# Altium schematic sheet UART_connect.SchDoc
size A4; DocumentNumber: 10; SheetNumber: 10; SheetTotal: 21; SheetName: UART to USB Bridge
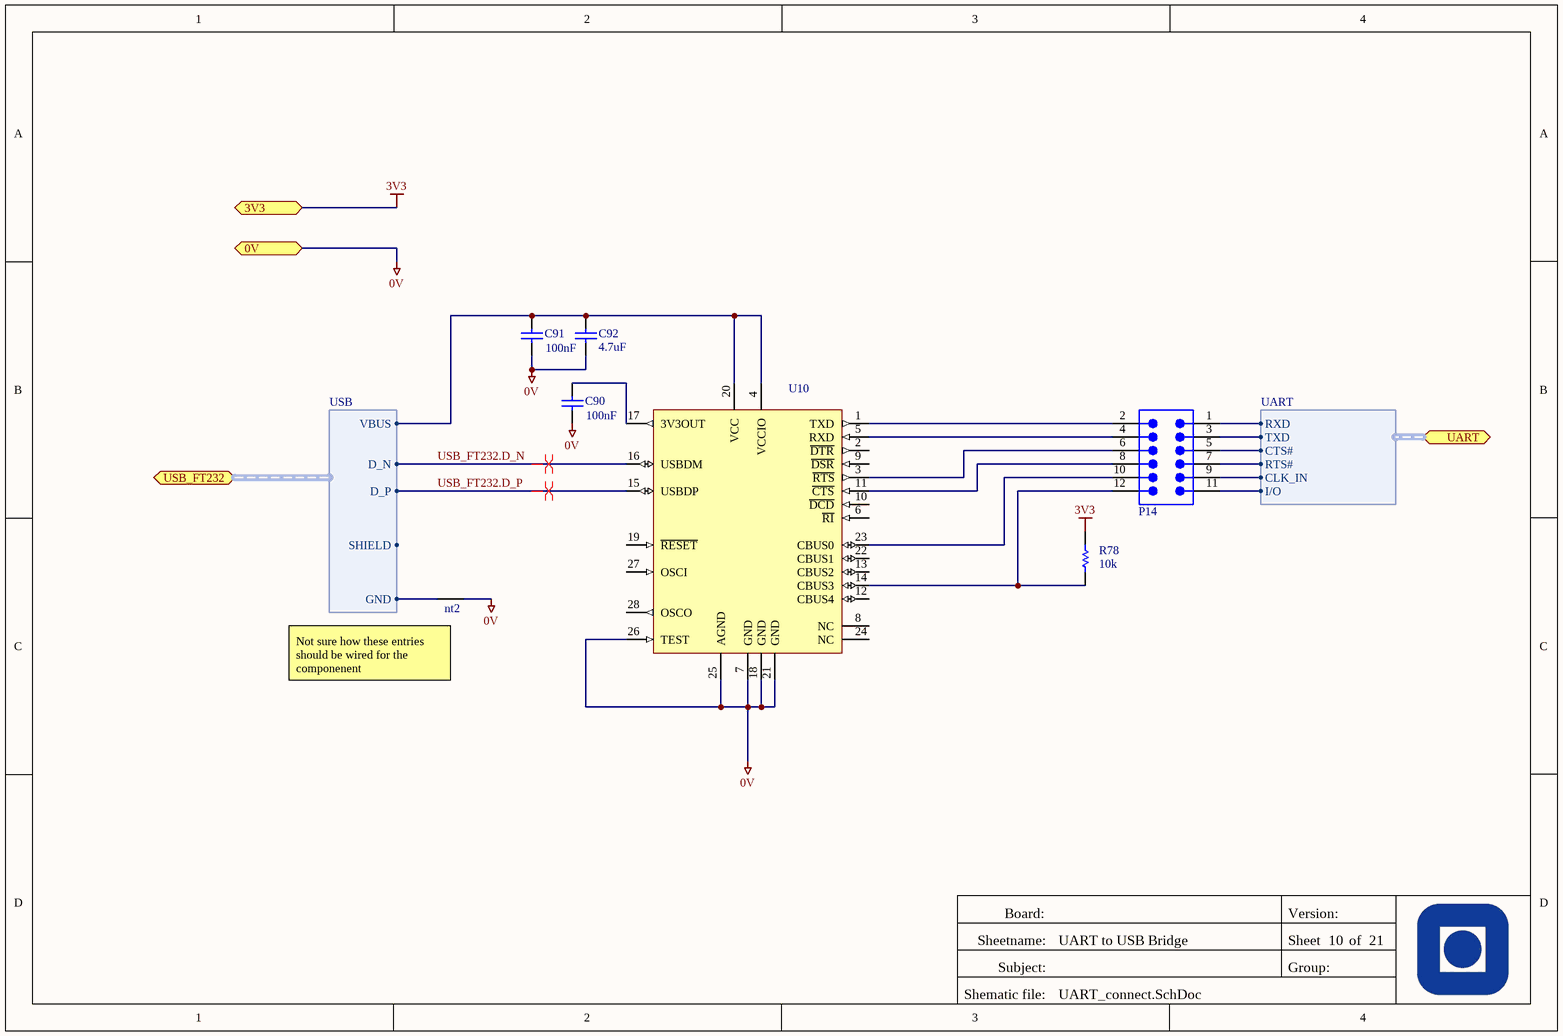
[diagram p0: UART_connect.SchDoc]

## Parts
C90  value 100nF  [CAPC0603(1608)100_M]  (hidden comment: CAP 100nF 16V 0603(1608))
C91  value 100nF  [CAPC0603(1608)100_M]  (hidden comment: CAP 100nF 16V 0603(1608))
C92  value 4.7uF  [CAPC0603(1608)100_M]  (hidden comment: CAP 4.7uF 16V 0603(1608))
nt2  net tie  [net tie]  (value not drawn)  (net tie, no BOM)
P14  TSW-106-07-T-D  [SMTC-TSW-106-07-X-D]  (value not drawn)
R78  value 10k  [RESC0603(1608)_N]  (hidden comment: 10K 1% 0603(1608))
U10  FT232RL-Reel  [SSOP-28_L]  (value not drawn)

## Ports
0V, 3V3, UART (harness UART), USB_FT232 (harness USB)

## Harnesses
UART: TXD, RXD, CTS#, RTS#, CLK_IN, I/O
USB: D_P, D_N, VBUS, GND, SHIELD

## Nets
0V: C90.1 C91.1 C92.1 nt2.1 U10.7(GND) U10.18(GND) U10.21(GND) U10.25(AGND) U10.26(TEST) ; port 0V
3V3: R78.2 ; port 3V3
USB_FT232.D_N: U10.16(USBDM) ; port USB_FT232.D_N
USB_FT232.D_P: U10.15(USBDP) ; port USB_FT232.D_P
NetC90_2: C90.2 U10.17(3V3OUT)
NetC91_2: C91.2 C92.2 U10.4(VCCIO) U10.20(VCC) ; port USB_FT232.VBUS
Netnt2_0: nt2.0 ; port USB_FT232.GND
NetP14_1: P14.1 ; port UART.RXD
NetP14_2: P14.2 U10.1(TXD)
NetP14_3: P14.3 ; port UART.TXD
NetP14_4: P14.4 U10.5(RXD)
NetP14_5: P14.5 ; port UART.CTS#
NetP14_6: P14.6 U10.3(~{RTS})
NetP14_7: P14.7 ; port UART.RTS#
NetP14_8: P14.8 U10.11(~{CTS})
NetP14_9: P14.9 ; port UART.CLK_IN
NetP14_10: P14.10 U10.23(CBUS0)
NetP14_11: P14.11 ; port UART.I/O
NetP14_12: P14.12 R78.1 U10.14(CBUS3)

Not connected (* = marked no-connect by the designer): U10 2(~{DTR}) 6(~{RI}) 8(NC) 9(~{DSR}) 10(~{DCD}) 12(CBUS4) 13(CBUS2) 19(~{RESET}) 22(CBUS1) 24(NC) 27(OSCI) 28(OSCO)

## Layout directives
differential pair: USB_FT232.D_N, USB_FT232.D_P

## Notes on the sheet
- (near nt2) Not sure how these entries should be wired for the componenent
- Board:
- Version:
- Sheetname:
- Subject:
- Group:
- Sheet
- of
- Shematic file:

## Library data of the parts
C90 C91 = CMP-1035-02583-1: CAP 100nF 16V ±5% 0603 (1608 Metric) Thickness 1mm SMD; Tolerance: Â±5%; Case-Metric: 1608; Case-EIA: 0603; Rated Voltage: 16 V; Max Thickness: 1 mm; Technology: SMT
C92 = CMP-1035-02788-1: CAP 4.7uF 16V ±10% 0603 (1608 Metric) Thickness 1mm SMD; Case-Metric: 1608; Tolerance: Â±10%; Case-EIA: 0603; Technology: SMT; Rated Voltage: 16 V; Max Thickness: 1 mm
nt2 = net tie: used to connect nets without transferring net name
P14 = CMP-1024-00380-1: Manufacturer: Samtec; Pitch: 2.54 mm; Orientation: Vertical; Mounting Technology: Through-hole; ComponentLink2URL: http://www.samtec.com/documents/webfiles/pdf/TSW_TH.PDF; Temperature Range: -55 to 105 degC; ComponentLink1URL: http://www.samtec.com; PackageReference: TSW-106-07-X-D; ComponentLink3Description: Package Specification; ComponentLink1Description: Manufacturer URL; PackageDescription: .025[0.64] SQ. Post Terminal Strip Assembly; PackageVersion: DM, 8/1988; ComponentLink2Description: Datasheet; ComponentLink3URL: http://www.samtec.com/documents/webfiles/cpdf/TSW-XXX-XX-XXX-X-XX-XXX-MKT.pdf; DatasheetVersion: F-214; RoHS: True; PartNumber: TSW-106-07-T-D
R78 = CMP-1012-00623-1: 10K 0.1W 1% 0603 (1608 Metric)  SMD; Case-EIA: 0603; Case-Metric: 1608; Power: 0.1 W; Tolerance: 1 %; Technology: SMT
U10 = CMP-0078-00029-1: USB UART Asynchronous Serial Data Transfer Chip, SSOP-28, Tape and Reel; DatasheetVersion: ver 2.07, Jul-2010; PackageDescription: 28-Pin Small Outline Package 0.65 mm Pitch; PackageVersion: 2010; PackageReference: SSOP-28